# Altium schematic sheet uart_optoizolation.SchDoc: UART Optoizolation
size A4
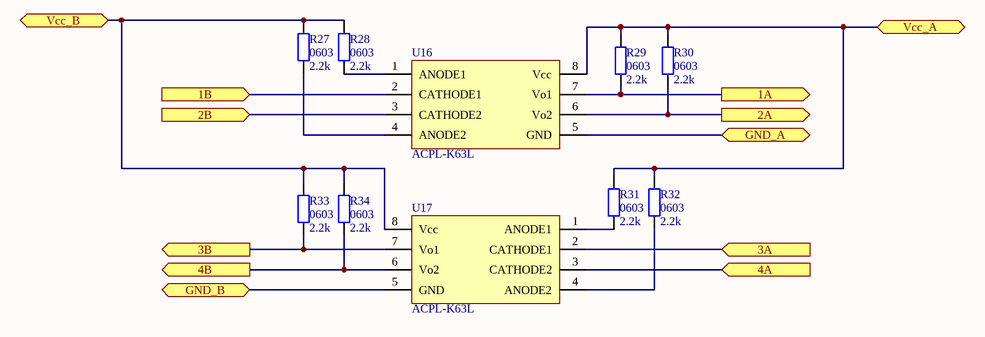
[diagram p0: uart_optoizolation.SchDoc]

## Parts
R27  0603  value 2.2k  [SMD_Resistor_0603]
R28  0603  value 2.2k  [SMD_Resistor_0603]
R29  0603  value 2.2k  [SMD_Resistor_0603]
R30  0603  value 2.2k  [SMD_Resistor_0603]
R31  0603  value 2.2k  [SMD_Resistor_0603]
R32  0603  value 2.2k  [SMD_Resistor_0603]
R33  0603  value 2.2k  [SMD_Resistor_0603]
R34  0603  value 2.2k  [SMD_Resistor_0603]
U16  ACPL-K63L  [SOIC-8_M]
U17  ACPL-K63L  [SOIC-8_M]

## Ports
1A (out), 1B (in), 2A (out), 2B (in), 3A (in), 3B (out), 4A (in), 4B (out), GND_A, GND_B, Vcc_A, Vcc_B

## Nets
1A: R29.1 U16.7(Vo1) ; port 1A
1B: U16.2(CATHODE1) ; port 1B
2A: R30.1 U16.6(Vo2) ; port 2A
2B: U16.3(CATHODE2) ; port 2B
3A: U17.2(CATHODE1) ; port 3A
3B: R33.1 U17.7(Vo1) ; port 3B
4A: U17.3(CATHODE2) ; port 4A
4B: R34.1 U17.6(Vo2) ; port 4B
GND_A: U16.5(GND) ; port GND_A
GND_B: U17.5(GND) ; port GND_B
Vcc_A: R29.2 R30.2 R31.2 R32.2 U16.8(Vcc) ; port Vcc_A
Vcc_B: R27.2 R28.2 R33.2 R34.2 U17.8(Vcc) ; port Vcc_B
NetR27_1: R27.1 U16.4(ANODE2)
NetR28_1: R28.1 U16.1(ANODE1)
NetR31_1: R31.1 U17.1(ANODE1)
NetR32_1: R32.1 U17.4(ANODE2)

## Notes on the sheet
- Title:
- Sheet:
- of
- Author:
- Model:
- Document Number:
- Checked by:
- Iss-Rev:
- Approved by:
- Date:
- File name:

## Library data of the parts
R27-R34 = Res2: Resistor; Published: 8-Jun-2000; LatestRevisionDate: 17-Jul-2002; LatestRevisionNote: Re-released for DXP Platform.; PackageReference: AXIAL-0.4; Publisher: Altium Limited; PackageDescription: Axial Device, Thru-Hole; 2 Leads; 0.4 in Pin Spacing
U16 U17 = ACPL-K63L: High Speed LVTTL Compatible 3.3 Volt/5 Volt Optocouplers